# Altium schematic sheet power.SchDoc
size A4
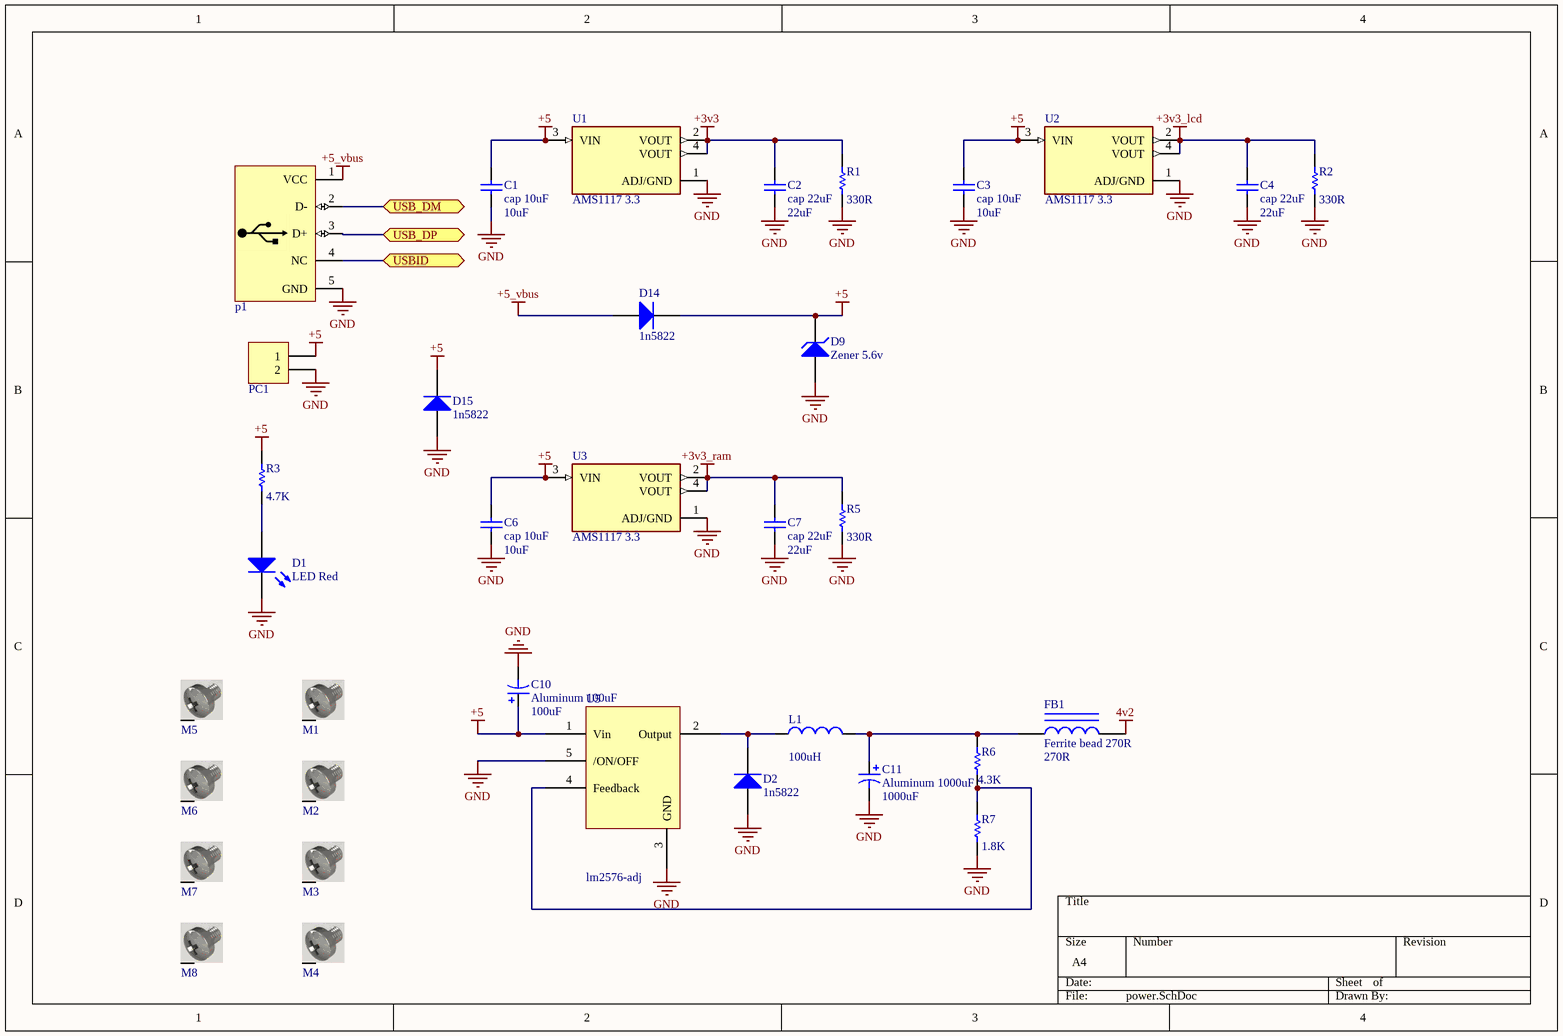
[diagram p0: power.SchDoc]

## Parts
C1  cap 10uF  value 10uF  [Cap 805]
C2  cap 22uF  value 22uF  [Cap 805]
C3  cap 10uF  value 10uF  [Cap 805]
C4  cap 22uF  value 22uF  [Cap 805]
C6  cap 10uF  value 10uF  [Cap 805]
C7  cap 22uF  value 22uF  [Cap 805]
C10  Aluminum 100uF  value 100uF  [Cap SMD 100UF 35~50v]
C11  Aluminum 1000uF  value 1000uF  [CAP SMD 1000UF 16V]
D1  LED Red  [0805-LED]
D2  1n5822  [SMA DIODE 2]
D9  Zener 5.6v  [Diode 1n4148 SMD]
D14  1n5822  [SMA DIODE 2]
D15  1n5822  [SMA DIODE 2]
FB1  Ferrite bead 270R  value 270R  [FB1206]
L1  value 100uH  [inductor]  (hidden comment: inductor 100uH)
M1  Spacer-ff 10mm  [Screw]  (value not drawn)
M2  Spacer-ff 10mm  [screw]  (value not drawn)
M3  Spacer-ff 10mm  [screw]  (value not drawn)
M4  Spacer-ff 10mm  [screw]  (value not drawn)
M5  Spacer-ff 10mm  [Screw]  (value not drawn)
M6  Spacer-ff 10mm  [screw]  (value not drawn)
M7  Spacer-ff 10mm  [screw]  (value not drawn)
M8  Spacer-ff 10mm  [screw]  (value not drawn)
p1  USB Connector  [USB_AB_BM_SHS]  (value not drawn)
PC1  Power Connector  [My_ Power_Connector]  (value not drawn)
R1  value 330R  [RES 0805 (2012X06L)]  (hidden comment: Res 330R)
R2  value 330R  [RES 0805 (2012X06L)]  (hidden comment: Res 330R)
R3  value 4.7K  [RES 0805 (2012X06L)]  (hidden comment: Res 4.7K)
R5  value 330R  [RES 0805 (2012X06L)]  (hidden comment: Res 330R)
R6  value 4.3K  [RES 0805 (2012X06L)]  (hidden comment: Res 4.3K)
R7  value 1.8K  [RES 0805 (2012X06L)]  (hidden comment: Res 1.8K)
U1  AMS1117 3.3  [SOT229P700X180-4N]
U2  AMS1117 3.3  [SOT229P700X180-4N]
U3  AMS1117 3.3  [SOT229P700X180-4N]
U5  lm2576-adj  [2596]

## Ports
USB_DM (bidir), USB_DP (bidir), USBID (bidir)

## Nets
4v2: FB1.2
+3v3: C2.2 R1.2 U1.2(VOUT) U1.4(VOUT)
+3v3_lcd: C4.2 R2.2 U2.2(VOUT) U2.4(VOUT)
+3v3_ram: C7.2 R5.2 U3.2(VOUT) U3.4(VOUT)
+5: C1.2 C3.2 C6.2 C10.1 D9.2(K) D14.2(K) D15.2(K) PC1.1 R3.2 U1.3(VIN) U2.3(VIN) U3.3(VIN) U5.1(Vin)
+5_vbus: D14.1(A) p1.1(VCC)
GND: C1.1 C2.1 C3.1 C4.1 C6.1 C7.1 C10.2 C11.2 D1.2(K) D2.1(A) D9.1(A) D15.1(A) p1.5(GND) PC1.2 R1.1 R2.1 R5.1 R7.1 U1.1(ADJ/GND) U2.1(ADJ/GND) U3.1(ADJ/GND) U5.3(GND) U5.5(/ON/OFF)
USB_DM: p1.2(D-) ; port USB_DM
USB_DP: p1.3(D+) ; port USB_DP
USBID: p1.4(NC) ; port USBID
NetC11_1: C11.1 FB1.1 L1.2 R6.2
NetD1_1: D1.1(A) R3.1
NetD2_2: D2.2(K) L1.1 U5.2(Output)
NetR6_1: R6.1 R7.2 U5.4(Feedback)

Not connected (* = marked no-connect by the designer): M1 S; M2 S; M3 S; M4 S; M5 S; M6 S; M7 S; M8 S

## Library data of the parts
C1-C4 C6 C7 = Cap: Capacitor; Published: 8-Jun-2000; LatestRevisionDate: 17-Jul-2002; LatestRevisionNote: Re-released for DXP Platform.; PackageReference: RAD-0.3; Publisher: Altium Limited; PackageDescription: Radial Cap, Thru-Hole; 2 Leads; 0.3 in Pin Spacing
C10 C11 = Cap Pol1: Polarized Capacitor Aluminum; Published: 8-Jun-2000; LatestRevisionDate: 17-Jul-2002; LatestRevisionNote: Re-released for DXP Platform.; PackageReference: RB7.6-15; Publisher: Altium Limited; PackageDescription: Polarized Capacitor (Radial); 2 Leads
D1 = LED0: LED SMD; pin to pad: 1>A 2>C; Published: 8-Jun-2000; LatestRevisionDate: 08-Jul-2005; LatestRevisionNote: Mech Layer 1 removed.; PackageReference: LED-0; Publisher: Altium Limited; PackageDescription: LED; 2 Leads
D2 D14 D15 = Diode 1N4007: 1 Amp schottky Diode; Published: 8-Jun-2000; LatestRevisionDate: 17-Jul-2002; LatestRevisionNote: Re-released for DXP Platform.; DatasheetVersion: 1998; PackageVersion: Aug-1999; PackageReference: DO-41; Publisher: Altium Limited; PackageDescription: Diode, Axial; Body 5.2 x 2.7 mm (LxDia. max), Lead Dia. 0.86 mm (max); Code_JEDEC: DO-204-AL; ComponentLink1Description: Manufacturer Link; ComponentLink1URL: http://www.fairchildsemi.com/; ComponentLink2Description: Datasheet; ComponentLink2URL: http://www.fairchildsemi.com/ds/1N%2F1N4001.pdf
D9 = D Zener: Zener Diode; Published: 8-Jun-2000; LatestRevisionDate: 17-Jul-2002; LatestRevisionNote: Re-released for DXP Platform.; PackageReference: DIODE-0.7; Publisher: Altium Limited; PackageDescription: Diode, Thru-Hole; 2 Leads; 0.7 in Pin Spacing
FB1 = Inductor Iron: Ferrite bead smd 1206; Published: 24-Mar-1999; LatestRevisionDate: 17-Jul-2002; LatestRevisionNote: Re-released for DXP Platform.; PackageReference: AXIAL-0.9; Publisher: Altium Limited; PackageDescription: Axial Device, Thru-Hole; 2 Leads; 0.9 in Pin Spacing
L1 = Inductor: Inductor 12*12mm; Code_IEC: 1005; Published: 8-Jun-2000; LatestRevisionDate: 29-May-2009; LatestRevisionNote: IPC-7351 Footprint Added.; PackageReference: 0402-A; Publisher: Altium Limited; PackageDescription: Chip Inductor; Code_JEITA: 0402
M1-M8 = Board Screw: Board Screw With Spacer
p1 = USB MICRO: USB Connector MICRO-B Type; Designer: ABBAS BASEREH; Max Current: 1600mA; Mounting Technology: Surface Mount\Through-Hole; Category: Connector; Pin Count: 5-7; Publisher: ABBAS BASEREH; Status: Unreleased; ComponentLink1Description: Datasheet; ComponentLink2Description: Reference; Update: 1395-11-17
PC1 = Power Connector: white Power Connector
R1-R3 R5-R7 = Res1: Resistor; Published: 8-Jun-2000; LatestRevisionDate: 17-Jul-2002; LatestRevisionNote: Re-released for DXP Platform.; PackageReference: AXIAL-0.3; Publisher: Altium Limited; PackageDescription: Axial Device, Thru-Hole; 2 Leads; 0.3 in Pin Spacing
U1-U3 = AMS1117: MF: Seeed Technology; Availability: Unavailable; SnapEDA_Link: https://www.snapeda.com/parts/AMS1117/Seeed%20Technology%20Co.%2C%20Ltd/view-part/184428/?ref=snap; MP: AMS1117; Price: None; Value: *; Package: SOT-223 Seeed Technology
U5 = lm2596